# EAGLE design LM_386_audio_amplifier (EAGLE 8.6.2)
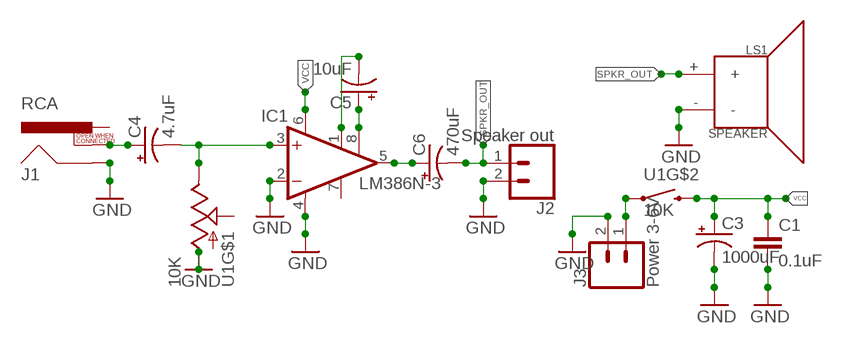
[diagram p0: schematic, sheet 1]

## Parts
C1  0.1uF  0.1UF-0603-25V-5%  [0603]
C3  1000uF  100UF-POLAR-10X10.5-63V-20%  [NIC_10X10.5_CAP]
C4  4.7uF  100UF-POLAR-10X10.5-63V-20%  [NIC_10X10.5_CAP]
C5  10uF  100UF-POLAR-10X10.5-63V-20%  [NIC_10X10.5_CAP]
C6  470uF  100UF-POLAR-10X10.5-63V-20%  [NIC_10X10.5_CAP]
IC1  LM386N-3  [DIL08]
J1  RCA  [RCA]
J2  Speaker out  CONN_02-JST-2-PTH-NO_SILK  [JST-2-PTH-NS]
J3  Power 3-6V  CONN_02-JST-2-PTH-NO_SILK  [JST-2-PTH-NS]
LS1  SPEAKER  [PCB_MOUNT_SPEAKER]
U1  10K  POT_SWITCHPOT_PTH  [POT_PTH]

## Nets
GND: C1.2 C3.- IC1.2(-IN) IC1.4(GND) J1.SHELL J2.2 J3.2 LS1.- U1.E@1(A)
N$1: C4.- IC1.3(+IN) U1.E@2(E)
N$2: C4.+ J1.SWITCH
N$3: C6.+ IC1.5(OUT)
N$4: C5.+ IC1.8(GAIN)
N$5: C5.- IC1.1(GAIN)
N$8: J3.1 U1.S1
SPKR_OUT: C6.- J2.1 LS1.+
VCC: C1.1 C3.+ IC1.6(VS) U1.S2
Unconnected: IC1.7(BYPASS) J1.PIN U1.WAND(S)

## Library data of the parts
C1 = SparkFun-Capacitors:0.1UF: 0.1µF ceramic capacitors A capacitor is a passive two-terminal electrical component used to store electrical energy temporarily in an electric field.; PROD_ID: CAP-08604
C3-C6 = SparkFun-Capacitors:100UF-POLAR: 100µF polarized capacitors A capacitor is a passive two-terminal electrical component used to store electrical energy temporarily in an electric field.; PROD_ID: CAP-08362; VALUE: 100uF
IC1 = linear:LM386?-*: Low Voltage Audio Power Amplifier Source: http://cache.national.com/ds/LM/LM386.pdf
J1 = SparkFun-Connectors:RCA: RCA Jack connector This is a right angle RCA jack connecotr. Commonly used for video or audio. Here is the connector we sell at SparkFun: RCA Jack <https://www.sparkfun.com/products/8631> (PRT-08631) Datasheet <http://www.sparkfun.com/datasheets/Prototyping/Connectors/RCA-Jack.pdf> It is not used on any active designs, however it was used on a couple retired products: RCA Jack Breakout [RETIRED] <https://www.sparkfun.com/products/8826> (PRT-08826) SparkFun On Screen Display Breakout - MAX7456 [RETIRED] <https://www.sparkfun.com/products/9168> (BOB-09168) You may also be interested in a cable: RCA Video Cable - 6' <https://www.sparkfun.com/products/11573> (CAB-11573); PROD_ID: CONN-09081; SF_ID: PRT-08631
J2 J3 = SparkFun-Connectors:CONN_02: Multi connection point. Often used as Generic Header-pin footprint for 0.1 inch spaced/style header connections On any of the 0.1 inch spaced packages, you can populate with these: Break Away Headers - Straight <https://www.sparkfun.com/products/116> (PRT-00116) Break Away Male Headers - Right Angle <https://www.sparkfun.com/products/553> (PRT-00553) Female Headers <https://www.sparkfun.com/products/115> (PRT-00115) Break Away Headers - Machine Pin <https://www.sparkfun.com/products/117> (PRT-00117) Break Away Female Headers - Swiss Machine Pin <https://www.sparkfun.com/products/743> (PRT-00743) For SCREWTERMINALS and SPRING TERMINALS visit here: Screw Terimnals on SparkFun.com <https://www.sparkfun.com/search/results?term=Screw+Terminals> (5mm/3.5mm/2.54mm spacing) This device is also useful as a general connection point to wire up your design to another part of your project. Our various solder wires solder well into these plated through hole pads. Hook-Up Wire - Assortment (Stranded, 22 AWG) <https://www.sparkfun.com/products/11375> (PRT-11375) Hook-Up Wire - Assortment (Solid Core, 22 AWG) <https://www.sparkfun.com/products/11367> (PRT-11367) View the entire wire category on our website here <https://www.sparkfun.com/categories/141> Special notes: Molex polarized connector foot print use with: PRT-08233 with associated crimp pins and housings. 2.54_SCREWTERM for use with PRT-10571. 3.5mm Screw Terminal footprints for PRT-08084 5mm Screw Terminal footprints for use with PRT-08432
LS1 = SparkFun-Electromechanical:SPEAKER: Speaker Generic 2-terminal loudspeakers SparkFun Products Speaker - PCB Mount <https://www.sparkfun.com/products/11089> (COM-11089); PROD_ID: COMP-11789; SF_SKU: COM-11089
U1 = SparkFun-Retired:POT_SWITCH: Potentiometer w/ switch.

## Board
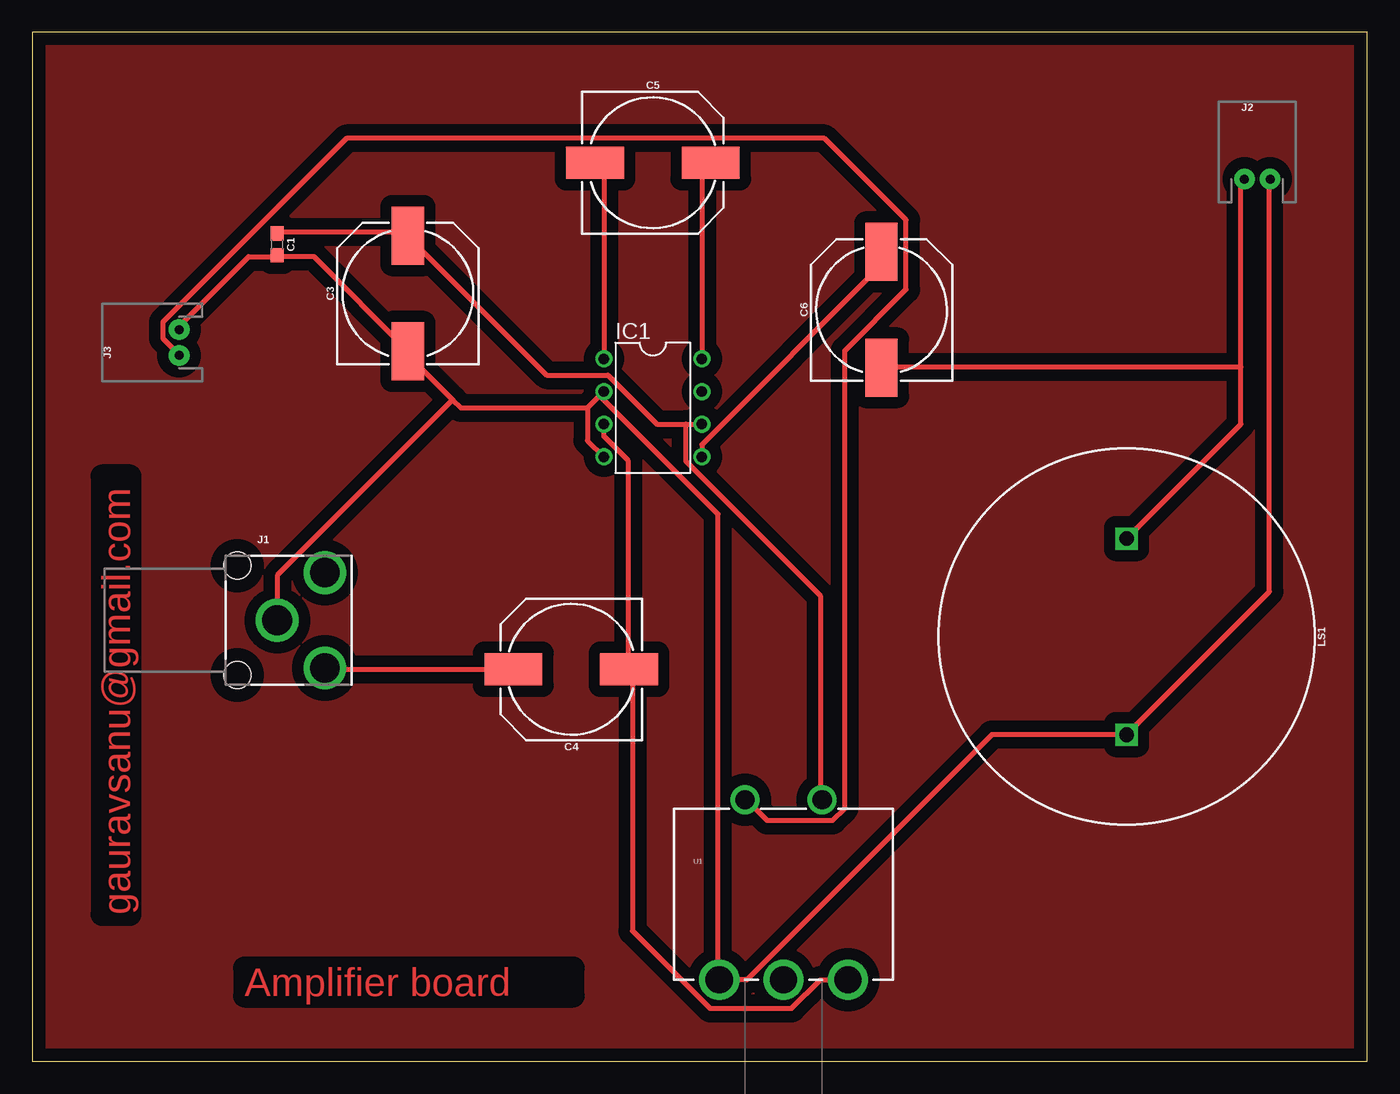
[diagram p1: board, top side]

Size 103.81 x 80 mm. Coordinates in mm from the lower left corner, seen from the top.
Outline: 0,0 103.81,0 103.81,80 0,80 0,0
Copper layers (1*16): Top 0.035mm / dielectric 1.5mm / Bottom 0.035mm
Design rules "default *": minimum track width 15mil, minimum drill 0.35mm, track to track 15mil, track to pad 10mil, pad to pad 6mil, via to via 6mil, smd to smd 6mil, copper to edge 40mil, drill to drill 6mil, minimum pad ring 10mil, minimum via ring 8mil, stop-mask expansion 4mil, vias tented up to drill 0mil, thermal gap 10mil

### Footprints (pad centres in the part's own frame; a part is rotated, then mirrored left to right if it is on the bottom)
0603 = smd 1.1 x 1: 1 -0.85,0; 2 0.85,0
NIC_10X10.5_CAP = smd 4.5 x 2.5: + 4.5,0; - -4.5,0
DIL08 = drill 0.813 pad 1.27: 1 -3.81,-3.81; 2 -1.27,-3.81; 3 1.27,-3.81; 4 3.81,-3.81; 5 3.81,3.81; 6 1.27,3.81; 7 -1.27,3.81; 8 -3.81,3.81
RCA = drill 2.3: PIN 3.7,3.7; SHELL 0,0; SWITCH 3.7,-3.7 | hole 2.1: -3.1,4.25; -3.1,-4.25
JST-2-PTH-NS = drill 0.7 pad 1.6: 1 -1,0; 2 1,0
PCB_MOUNT_SPEAKER = drill 1.143 square: + -7.62,0; - 7.62,0
POT_PTH = drill 2.1: E@1 -5,0; E@2 5,0; WAND 0,0 | drill 1.5: S1 -3,14; S2 3,14

### Placement (x,y rotation side)
C1  19.05,63.5 270 top
C3  29.21,59.69 90 top
C4  41.91,30.48 180 top
C5  48.26,69.85 0 top
C6  66.04,58.42 90 top
IC1  48.26,50.8 270 top
J1  19.05,34.29 0 top
J2  95.25,68.58 0 top
J3  11.43,55.88 90 top
LS1  85.09,33.02 270 top
U1  58.42,6.35 0 top

### Tracks (layer width: path | path; a pad name or v marks a point on that pad's centre or on a via)
GND
  Top 0.381: 19.05,62.55 16.83,62.55 11.43,57.15 J3.2 | IC1.4 43.18,48.26 43.18,50.8 | 44.13,51.75 43.18,50.8 | 43.18,50.8 33.34,50.8 32.7,51.44 | 32.7,51.44 29.21,54.93 C3.- 29.21,55.24 21.91,62.55 19.05,62.55 | 19.05,62.55 C1.2 | J1.SHELL 19.05,37.78 32.7,51.44 | J2.2 96.2,68.58 96.2,36.51 LS1.- 74.61,25.4 55.56,6.35 U1.E@1 53.34,6.35 53.34,42.55 44.13,51.75 | 44.13,51.75 IC1.2
N$1
  Top 0.381: IC1.3 44.45,48.58 46.36,46.67 46.36,30.48 C4.- 46.67,30.48 46.67,10.16 52.71,4.13 59.05,4.13 61.28,6.35 U1.E@2
N$2
  Top 0.381: C4.+ 22.86,30.48 J1.SWITCH
N$3
  Top 0.381: IC1.5 52.07,47.94 66.04,61.91 C6.+
N$4
  Top 0.381: IC1.8 52.07,69.22 52.71,69.85 C5.+
N$5
  Top 0.381: IC1.1 44.45,69.22 43.82,69.85 C5.-
N$6
  pour Top (isolate 0.889, no thermals): 0,80.01 104.14,80.01 104.14,77.47 104.14,0 101.6,0 0,0
N$8
  Top 0.381: J3.1 11.43,54.93 10.16,56.2 10.16,57.47 24.45,71.75 61.59,71.75 67.95,65.41 67.95,60.01 63.18,55.24 63.18,19.68 62.23,18.73 57.15,18.73 55.56,20.32 U1.S1
SPKR_OUT
  Top 0.381: 93.98,53.98 93.98,49.53 LS1.+ | 93.98,53.98 93.98,68.58 J2.1 | 93.98,53.98 66.04,53.98 C6.-
VCC
  Top 0.381: C1.1 19.05,64.45 29.21,64.45 C3.+ 29.21,64.14 40.01,53.34 44.77,53.34 48.58,49.53 50.8,49.53 | 50.8,49.53 IC1.6 | 50.8,49.53 50.8,46.67 61.28,36.2 61.28,20.64 U1.S2

### Text on the board
Top: gauravsanu@gmail.com | Amplifier board